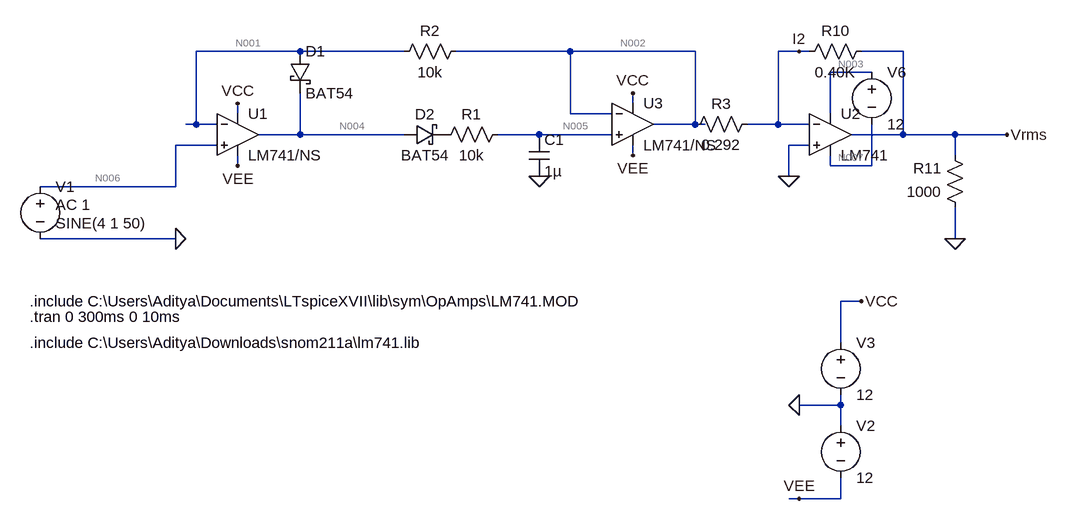
[diagram p0: schematic Draft5.asc]
Draft5.asc, the LTspice schematic file:
Version 4
SHEET 1 2596 872
WIRE 272 -144 112 -144
WIRE 432 -144 272 -144
WIRE 688 -144 512 -144
WIRE 880 -144 688 -144
WIRE 1040 -144 1008 -144
WIRE 1056 -144 1040 -144
WIRE 1200 -144 1136 -144
WIRE 1152 -112 1088 -112
WIRE 784 -64 784 -80
WIRE 176 -48 176 -64
WIRE 688 -48 688 -144
WIRE 752 -48 688 -48
WIRE 1088 -48 1088 -112
WIRE 112 -32 112 -144
WIRE 112 -32 96 -32
WIRE 144 -32 112 -32
WIRE 880 -32 880 -144
WIRE 880 -32 816 -32
WIRE 896 -32 880 -32
WIRE 1008 -32 1008 -144
WIRE 1008 -32 960 -32
WIRE 1056 -32 1008 -32
WIRE 272 -16 272 -80
WIRE 272 -16 208 -16
WIRE 432 -16 272 -16
WIRE 640 -16 576 -16
WIRE 752 -16 640 -16
WIRE 1200 -16 1200 -144
WIRE 1200 -16 1120 -16
WIRE 1280 -16 1200 -16
WIRE 1360 -16 1280 -16
WIRE 144 0 80 0
WIRE 1056 0 1024 0
WIRE 784 16 784 0
WIRE 1280 16 1280 -16
WIRE 176 32 176 16
WIRE 1088 32 1088 16
WIRE 1152 32 1152 -32
WIRE 1152 32 1088 32
WIRE 1024 48 1024 0
WIRE 80 64 80 0
WIRE 80 64 -128 64
WIRE 80 144 -128 144
WIRE 1280 144 1280 96
WIRE 1136 240 1104 240
WIRE 1104 304 1104 240
WIRE 1104 400 1104 384
WIRE 1104 400 1040 400
WIRE 1104 432 1104 400
WIRE 1040 544 1024 544
WIRE 1104 544 1104 512
WIRE 1104 544 1040 544
FLAG 80 144 0
FLAG 176 -64 VCC
FLAG 176 32 VEE
FLAG 640 48 0
FLAG 784 -80 VCC
FLAG 784 16 VEE
FLAG 1280 144 0
FLAG 1024 48 0
FLAG 1040 -144 I2
FLAG 1136 240 VCC
FLAG 1040 400 0
FLAG 1040 544 VEE
FLAG 1360 -16 Vrms
SYMBOL OpAmps\\opamp2 176 -80 R0
SYMATTR InstName U1
SYMATTR Value LM741/NS
SYMBOL voltage -128 48 R0
WINDOW 123 24 44 Left 2
WINDOW 39 0 0 Left 0
WINDOW 3 24 72 Left 2
SYMATTR Value2 AC 1
SYMATTR Value SINE(4 1 50)
SYMATTR InstName V1
SYMBOL schottky 256 -144 R0
SYMATTR InstName D1
SYMATTR Value BAT54
SYMATTR Description Diode
SYMATTR Type diode
SYMBOL schottky 432 0 R270
WINDOW 0 32 32 VTop 2
WINDOW 3 0 32 VBottom 2
SYMATTR InstName D2
SYMATTR Value BAT54
SYMATTR Description Diode
SYMATTR Type diode
SYMBOL cap 624 -16 R0
SYMATTR InstName C1
SYMATTR Value 1µ
SYMBOL res 592 -32 R90
WINDOW 0 0 56 VBottom 2
WINDOW 3 32 56 VTop 2
SYMATTR InstName R1
SYMATTR Value 10k
SYMBOL res 528 -160 R90
WINDOW 0 0 56 VBottom 2
WINDOW 3 32 56 VTop 2
SYMATTR InstName R2
SYMATTR Value 10k
SYMBOL OpAmps\\opamp2 784 -96 R0
SYMATTR InstName U3
SYMATTR Value LM741/NS
SYMBOL OpAmps\\opamp2 1088 -80 R0
SYMATTR InstName U2
SYMATTR Value LM741
SYMBOL res 976 -48 R90
WINDOW 0 0 56 VBottom 2
WINDOW 3 32 56 VTop 2
SYMATTR InstName R3
SYMATTR Value 0.292
SYMBOL res 1152 -160 R90
WINDOW 0 0 56 VBottom 2
WINDOW 3 32 56 VTop 2
SYMATTR InstName R10
SYMATTR Value 0.40K
SYMBOL res 1296 112 R180
WINDOW 0 36 76 Left 2
WINDOW 3 36 40 Left 2
SYMATTR InstName R11
SYMATTR Value 1000
SYMBOL voltage 1152 -128 R0
WINDOW 123 0 0 Left 0
WINDOW 39 0 0 Left 0
SYMATTR InstName V6
SYMATTR Value 12
SYMBOL voltage 1104 416 R0
WINDOW 123 0 0 Left 0
WINDOW 39 0 0 Left 0
SYMATTR InstName V2
SYMATTR Value 12
SYMBOL voltage 1104 288 R0
WINDOW 123 0 0 Left 0
WINDOW 39 0 0 Left 0
SYMATTR InstName V3
SYMATTR Value 12
TEXT -144 240 Left 2 !.include C:\\Users\\Aditya\\Documents\\LTspiceXVII\\lib\\sym\\OpAmps\\LM741.MOD
TEXT -144 264 Left 2 !.tran 0 300ms 0 10ms
TEXT -144 304 Left 2 !.include C:\\Users\\Aditya\\Downloads\\snom211a\\lm741.lib

The netlist it stands for:
* Draft5.asc
XU1 N006 N001 VCC VEE N004 LM741/NS  ; pins In+ In- V+ V- OUT
V1 N006 0 SINE(4 1 50) AC 1
D1 N001 N004 BAT54
D2 N004 P001 BAT54
C1 N005 0 1µ
R1 N005 P001 10k
R2 N002 N001 10k
XU3 N005 N002 VCC VEE N002 LM741/NS  ; pins In+ In- V+ V- OUT
XU2 0 I2 N003 N007 Vrms LM741  ; pins In+ In- V+ V- OUT
R3 I2 N002 0.292
R10 Vrms I2 0.40K
R11 0 Vrms 1000
V6 N003 N007 12
V2 0 VEE 12
V3 VCC 0 12
.model D D
.lib standard.dio
.include C:\Users\Aditya\Documents\LTspiceXVII\lib\sym\OpAmps\LM741.MOD
.tran 0 300ms 0 10ms
.include C:\Users\Aditya\Downloads\snom211a\lm741.lib
.backanno
.end

* Results of the author's LTspice run, read from the files saved beside the schematic
* Operating Point, zero values left out:
*   V(n001) = 4.001 V
*   V(n006) = 4 V
*   V(vee) = -12 V
*   V(vcc) = 12 V
*   V(n004) = 4.013 V
*   V(p001) = 4.001 V
*   V(n005) = 4.001 V
*   V(n002) = 4.002 V
*   V(i2) = 4.001 V
*   V(n007) = 1.885 V
*   V(n003) = 13.89 V
*   V(vrms) = 2.858 V
*   I(D2) = 57.69 nA
*   I(D1) = -36.9 nA
*   I(R11) = -2.858 mA
*   I(R10) = -2.858 mA
*   I(R3) = -2.866 mA
*   I(R2) = 65.15 nA
*   I(R1) = -57.69 nA
*   I(V3) = -6.042 mA
*   I(V2) = -3.176 mA
*   I(V6) = -1.368 mA
*   I(V1) = -57.68 nA
*   Ix(u1:1) = 57.68 nA
*   Ix(u1:2) = 102 nA
*   Ix(u1:99) = 1.626 mA
*   Ix(u1:50) = -1.626 mA
*   Ix(u1:28) = -94.59 nA
*   Ix(u3:1) = 57.69 nA
*   Ix(u3:2) = 102 nA
*   Ix(u3:99) = 4.416 mA
*   Ix(u3:50) = -1.55 mA
*   Ix(u3:28) = -2.866 mA
*   Ix(u2:1) = -8.022 µA
*   Ix(u2:2) = 8.182 µA
*   Ix(u2:99) = 1.368 mA
*   Ix(u2:50) = -1.368 mA
*   Ix(u2:28) = -159.7 nA
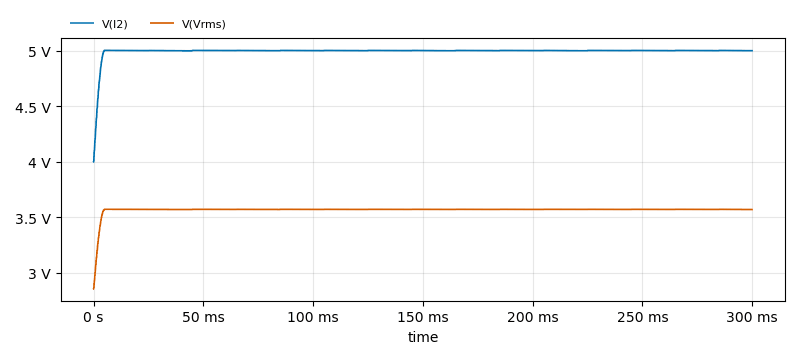
[diagram p1: Transient Analysis of Draft5.asc, plotted from the saved traces]
* Transient Analysis, 1 run:
*   V(I2): min 4.001 V, max 5.002 V, average 4.994 V, rms 4.994 V, last 4.999 V
*   V(Vrms): min 2.858 V, max 3.573 V, average 3.567 V, rms 3.567 V, last 3.571 V